# EAGLE schematic NHK2016mother (EAGLE 6.2)
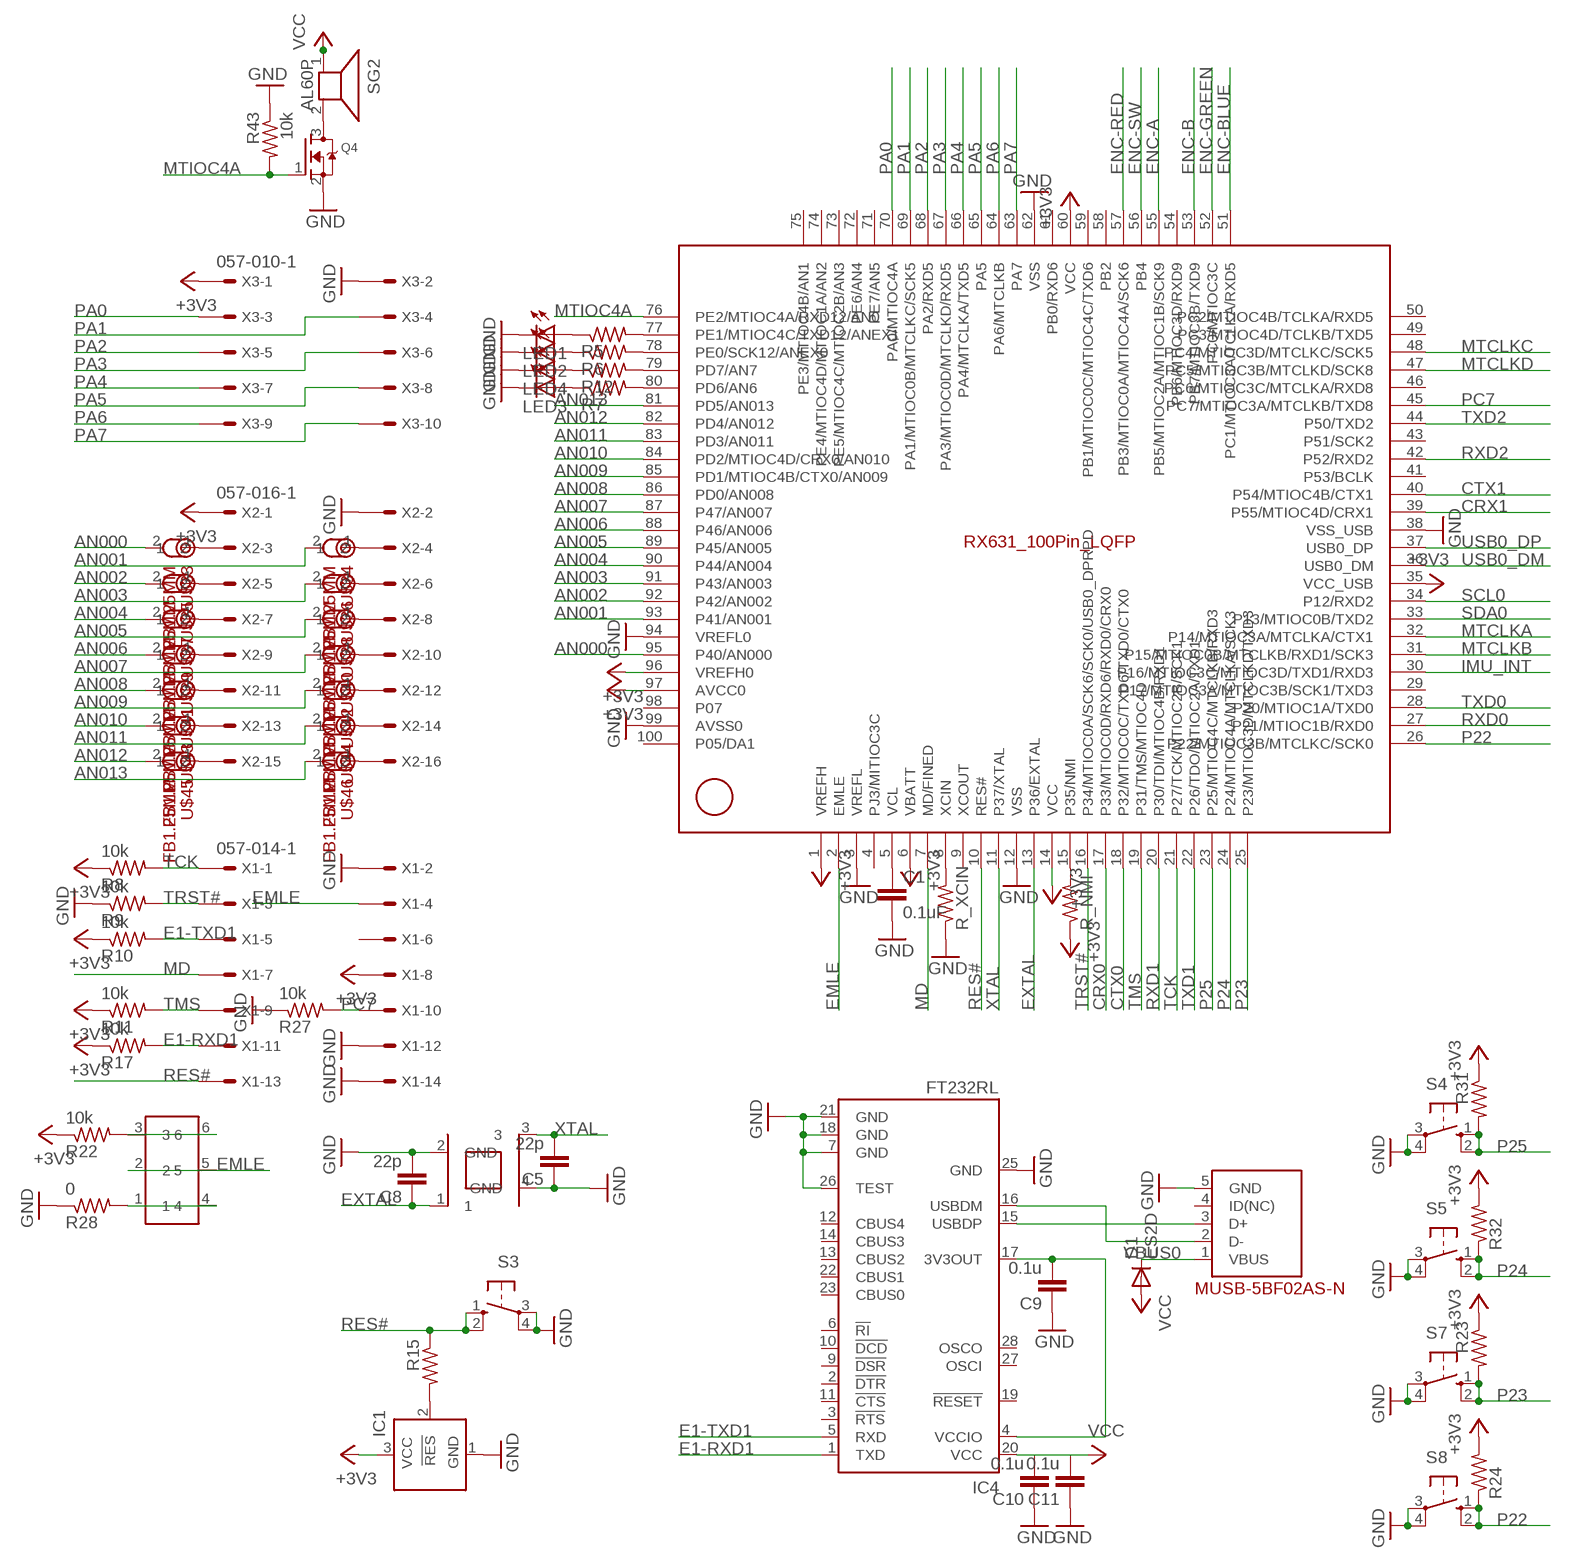
[diagram p0: schematic, sheet 1, part 1 of 2]
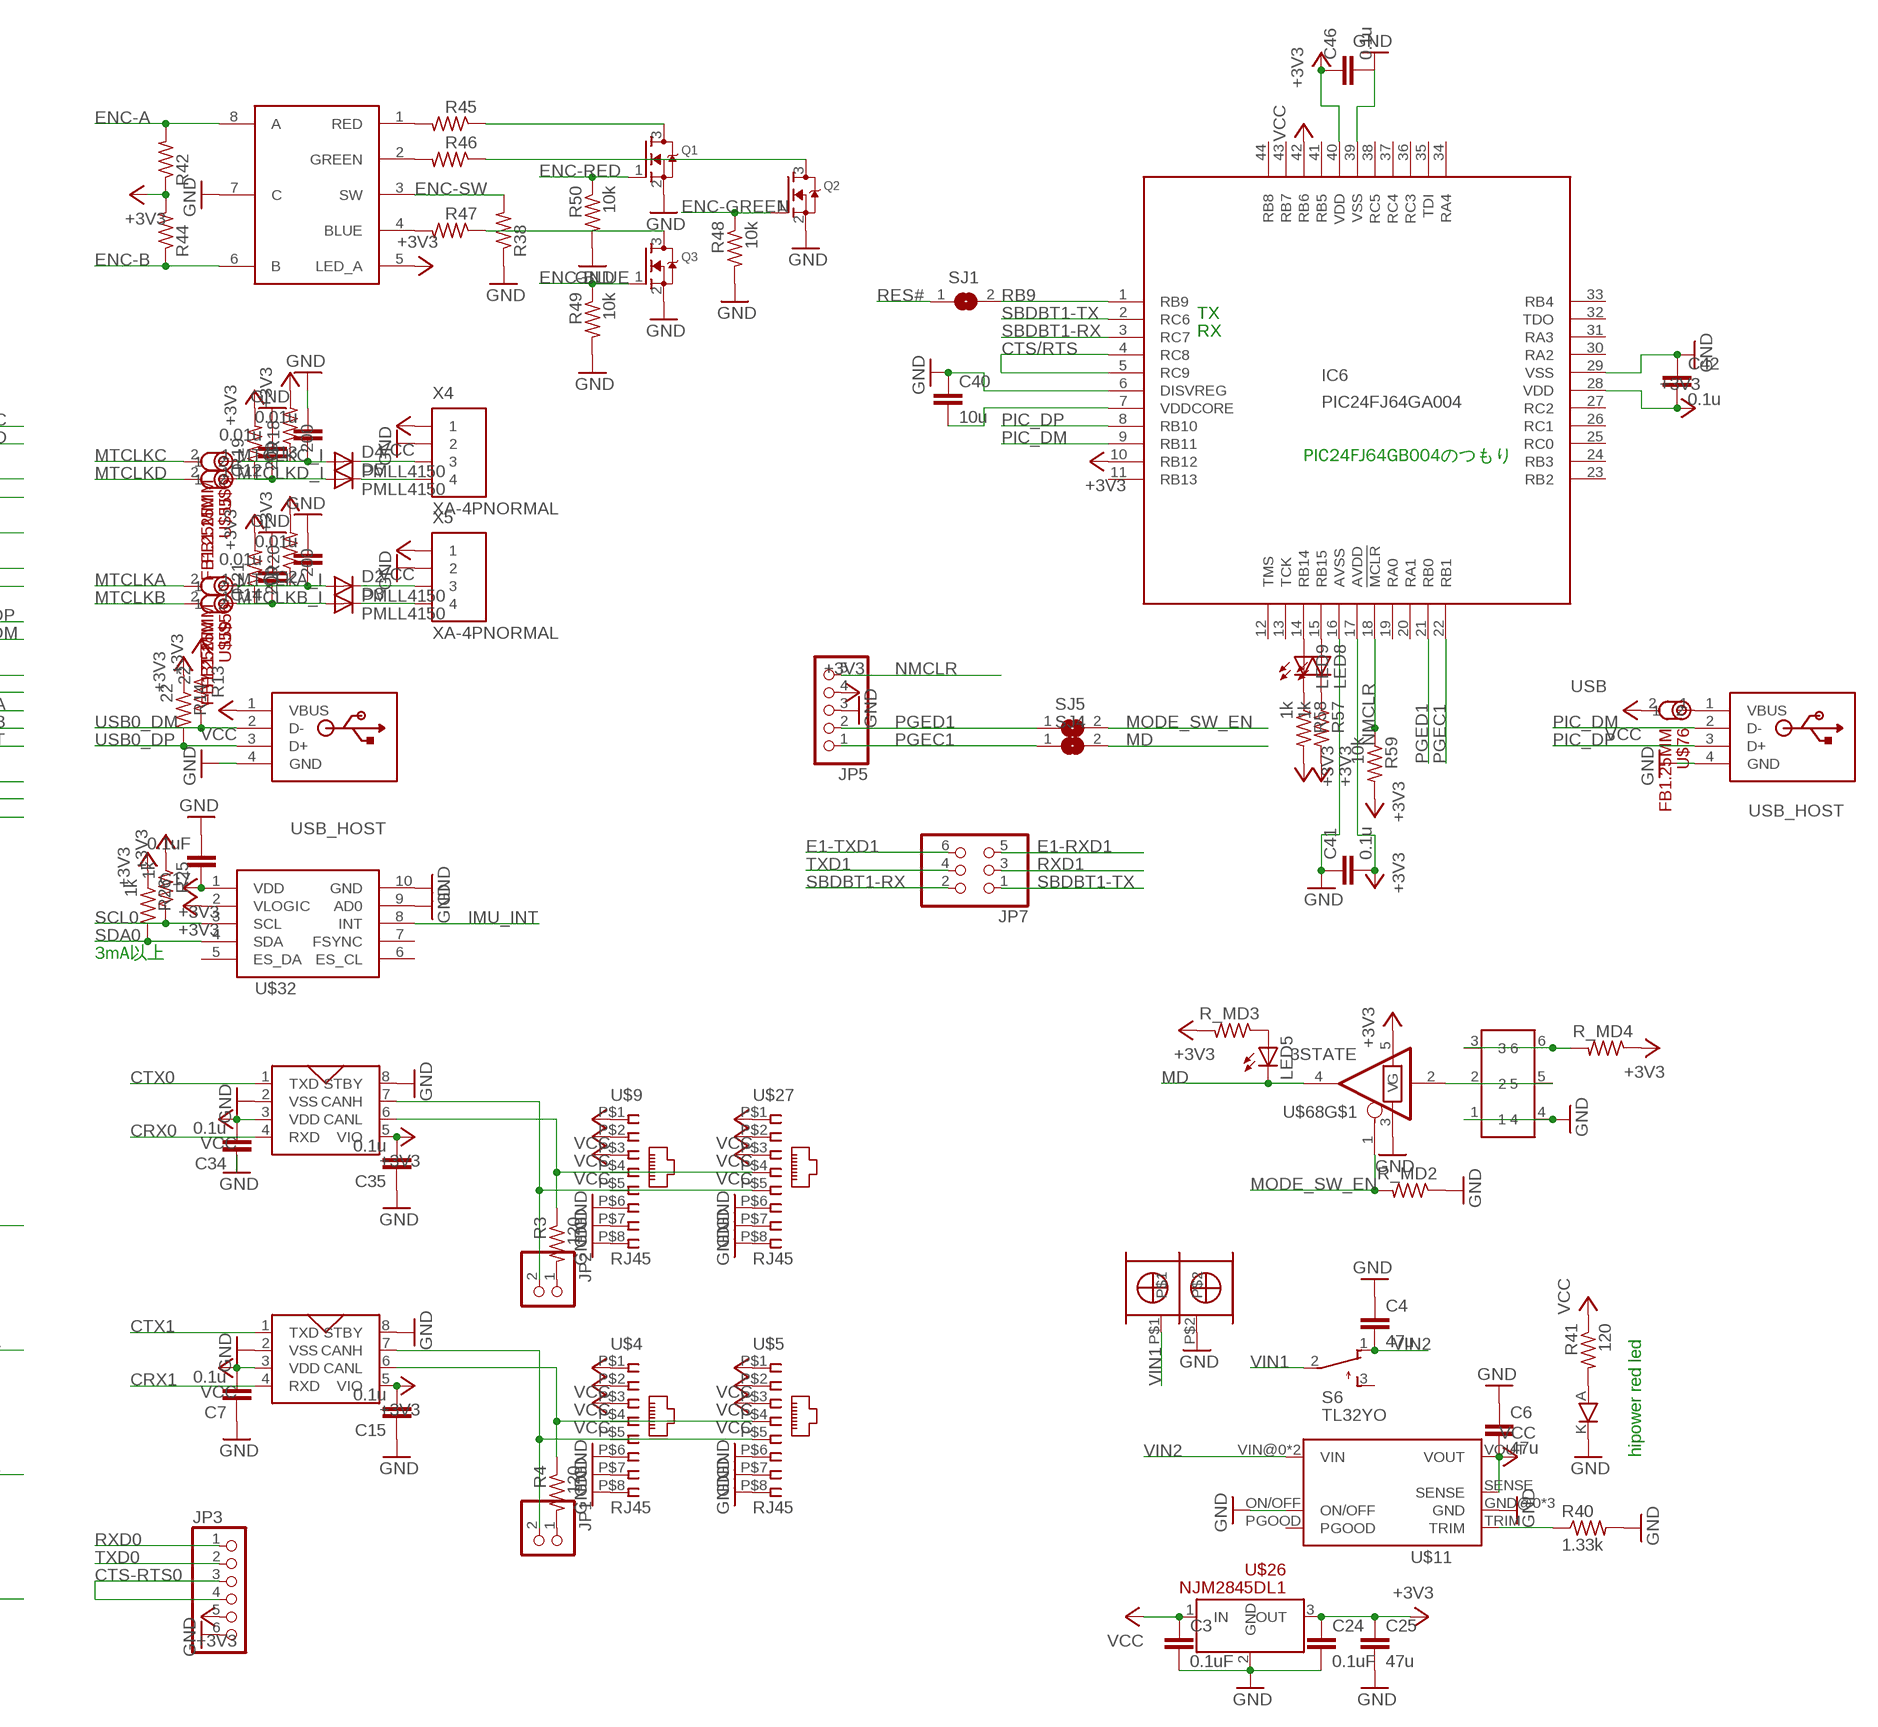
[diagram p1: schematic, sheet 1, part 2 of 2]

## Parts
C1  0.1uF  C-EUC0603K  [C0603K]
C2  0.01u  C-EUC0402  [C0402]
C3  0.1uF  C-EUC0603K  [C0603K]
C4  47u  C-EUC3225  [C3225]
C5  22p  C-EUC0603K  [C0603K]
C6  47u  C-EUC3225  [C3225]
C7  0.1u  C-EUC0402  [C0402]
C8  22p  C-EUC0603K  [C0603K]
C9  0.1u  C-EUC0402  [C0402]
C10  0.1u  C-EUC0402  [C0402]
C11  0.1u  C-EUC0402  [C0402]
C12  0.01u  C-EUC0402  [C0402]
C13  0.01u  C-EUC0402  [C0402]
C14  0.01u  C-EUC0402  [C0402]
C15  0.1u  C-EUC0402  [C0402]
C17  0.1uF  C-EUC0603K  [C0603K]
C24  0.1uF  C-EUC0603K  [C0603K]
C25  47u  C-EUC3225  [C3225]
C34  0.1u  C-EUC0402  [C0402]
C35  0.1u  C-EUC0402  [C0402]
C40  10u  C-EUC0603K  [C0603K]
C41  0.1u  C-EUC0603K  [C0603K]
C42  0.1u  C-EUC0603K  [C0603K]
C46  0.1u  C-EUC0603K  [C0603K]
D1  ES2D  [SMB]
D2  PMLL4150  [SOD80C]
D3  PMLL4150  [SOD80C]
D4  PMLL4150  [SOD80C]
D5  PMLL4150  [SOD80C]
IC1  TCM809  [SOT23B-3]
IC4  FT232RL  [SSOP28]
IC6  PIC24FJ64GA004  [TQFP44]
JP1  PINHD-1X2  [1X02]
JP2  PINHD-1X2  [1X02]
JP3  PINHD-1X6  [1X06]
JP5  PINHD-1X5  [1X05]
JP7  PINHD-2X3  [2X03]
LED1  LEDSML0805  [SML0805]
LED2  LEDSML0805  [SML0805]
LED3  LEDSML0805  [SML0805]
LED4  LEDSML0805  [SML0805]
LED5  LEDSML0805  [SML0805]
LED8  LEDSML0805  [SML0805]
LED9  LEDSML0805  [SML0805]
Q1  MOSFET-NREFLOW  [SOT23]
Q2  MOSFET-NREFLOW  [SOT23]
Q3  MOSFET-NREFLOW  [SOT23]
Q4  MOSFET-NREFLOW  [SOT23]
R3  120  R-US_MELF0102W  [MINI_MELF-0102W]
R4  120  R-US_MELF0102W  [MINI_MELF-0102W]
R5  R-US_MELF0102W  [MINI_MELF-0102W]
R6  R-US_MELF0102W  [MINI_MELF-0102W]
R7  R-US_MELF0102W  [MINI_MELF-0102W]
R8  10k  R-US_MELF0102W  [MINI_MELF-0102W]
R9  10k  R-US_MELF0102W  [MINI_MELF-0102W]
R10  10k  R-US_MELF0102W  [MINI_MELF-0102W]
R11  10k  R-US_MELF0102W  [MINI_MELF-0102W]
R12  R-US_MELF0102W  [MINI_MELF-0102W]
R13  22  R-US_MELF0102W  [MINI_MELF-0102W]
R14  22  R-US_MELF0102W  [MINI_MELF-0102W]
R15  R-US_MELF0102W  [MINI_MELF-0102W]
R17  10k  R-US_MELF0102W  [MINI_MELF-0102W]
R18  200  R-US_MELF0102W  [MINI_MELF-0102W]
R19  200  R-US_MELF0102W  [MINI_MELF-0102W]
R20  200  R-US_MELF0102W  [MINI_MELF-0102W]
R21  200  R-US_MELF0102W  [MINI_MELF-0102W]
R22  10k  R-US_MELF0102W  [MINI_MELF-0102W]
R23  R-US_MELF0102W  [MINI_MELF-0102W]
R24  R-US_MELF0102W  [MINI_MELF-0102W]
R25  1k  R-US_MELF0102W  [MINI_MELF-0102W]
R26  1k  R-US_MELF0102W  [MINI_MELF-0102W]
R27  10k  R-US_MELF0102W  [MINI_MELF-0102W]
R28  0  R-US_MELF0102W  [MINI_MELF-0102W]
R31  R-US_MELF0102W  [MINI_MELF-0102W]
R32  R-US_MELF0102W  [MINI_MELF-0102W]
R38  R-US_MELF0102W  [MINI_MELF-0102W]
R40  1.33k  R-US_MELF0102W  [MINI_MELF-0102W]
R41  120  R-US_MELF0102W  [MINI_MELF-0102W]
R42  R-US_MELF0102W  [MINI_MELF-0102W]
R43  10k  R-US_MELF0102W  [MINI_MELF-0102W]
R44  R-US_MELF0102W  [MINI_MELF-0102W]
R45  R-US_MELF0102W  [MINI_MELF-0102W]
R46  R-US_MELF0102W  [MINI_MELF-0102W]
R47  R-US_MELF0102W  [MINI_MELF-0102W]
R48  10k  R-US_MELF0102W  [MINI_MELF-0102W]
R49  10k  R-US_MELF0102W  [MINI_MELF-0102W]
R50  10k  R-US_MELF0102W  [MINI_MELF-0102W]
R57  1k  R-US_MELF0102W  [MINI_MELF-0102W]
R58  1k  R-US_MELF0102W  [MINI_MELF-0102W]
R59  10k  R-US_MELF0102W  [MINI_MELF-0102W]
R_MD2  R-US_MELF0102W  [MINI_MELF-0102W]
R_MD3  R-US_MELF0102W  [MINI_MELF-0102W]
R_MD4  R-US_MELF0102W  [MINI_MELF-0102W]
R_NMI  R-US_MELF0102W  [MINI_MELF-0102W]
R_XCIN  R-US_MELF0102W  [MINI_MELF-0102W]
S3  10-XX  [B3F-10XX]
S4  10-XX  [B3F-10XX]
S5  10-XX  [B3F-10XX]
S6  TL32YO  [TL3XYO]
S7  10-XX  [B3F-10XX]
S8  10-XX  [B3F-10XX]
SG2  AL60P  [AL60P]
SJ1  SJ  [SJ]
SJ4  SJ  [SJ]
SJ5  SJ  [SJ]
U$1  R5F5631FDDFP  [LQFP100]
U$2  MUSB-5BF02AS-N  [MUSB-5BF02AS-N]
U$3  MCP2562  [MCP2562]
U$4  RJ45  [RJ45]
U$5  RJ45  [RJ45]
U$6  FB1.25MM  [2012]
U$7  SSSS2  [SSSS2]
U$8  ＦＲ１１０５Ｗ－ＴＲ  [ＦＲ１１０５Ｗ－ＴＲ]
U$9  RJ45  [RJ45]
U$10  TERMINAL  [TERMINAL]
U$11  OKL_T6_W12  [OKL_T6_W12]
U$17  MCP2562  [MCP2562]
U$26  NJM2845DL1  [TO-252-3-L1]
U$27  RJ45  [RJ45]
U$29  USB_A  [USB_A]
U$32  MPU9150  [MPU9150]
U$33  FB1.25MM  [2012]
U$34  FB1.25MM  [2012]
U$35  FB1.25MM  [2012]
U$36  FB1.25MM  [2012]
U$37  FB1.25MM  [2012]
U$38  FB1.25MM  [2012]
U$39  FB1.25MM  [2012]
U$40  FB1.25MM  [2012]
U$41  FB1.25MM  [2012]
U$42  FB1.25MM  [2012]
U$43  FB1.25MM  [2012]
U$44  FB1.25MM  [2012]
U$45  FB1.25MM  [2012]
U$46  FB1.25MM  [2012]
U$55  FB1.25MM  [2012]
U$56  FB1.25MM  [2012]
U$58  EC12PLRGBSDVBF  [EC12PLRGBSDVBF]
U$59  FB1.25MM  [2012]
U$61  FA238V  [FA238V]
U$68  3STATE  [SOT23-5]
U$75  USB_A  [USB_A]
U$76  FB1.25MM  [2012]
U$82  SSSS2  [SSSS2]
X1  057-014-1  [057-014-1]
X2  057-016-1  [057-016-1]
X3  057-010-1  [057-010-1]
X4  XA-4PNORMAL  [XA-4P]
X5  XA-4PNORMAL  [XA-4P]

## Nets
+3V3: C15.2 C17.1 C24.1 C25.1 C35.2 C41.2 C42.2 C46.1 IC1.3(VCC) IC6.10(RB12) IC6.17(AVDD) IC6.28(VDD) IC6.40(VDD) JP3.5 JP5.4 R8.1 R10.1 R11.1 R13.1 R14.1 R17.1 R18.2 R19.2 R20.2 R21.2 R22.1 R23.1 R24.2 R25.1 R26.1 R31.1 R32.2 R42.1 R44.2 R57.2 R58.2 R59.2 R_MD3.2 R_MD4.1 R_NMI.1 U$1.1(VREFH) U$1.6(VBATT) U$1.14(VCC) U$1.35(VCC_USB) U$1.60(VCC) U$1.96(VREFH0) U$1.97(AVCC0) U$3.5(VIO) U$17.5(VIO) U$26.3(OUT) U$32.1(VDD) U$32.2(VLOGIC) U$58.5(LED_A) U$68.5(V) X1.8 X2.1 X3.1
AN000: U$1.95(P40/AN000) U$33.2
AN001: U$1.93(P41/AN001) U$34.2
AN002: U$1.92(P42/AN002) U$35.2
AN003: U$1.91(P43/AN003) U$36.2
AN004: U$1.90(P44/AN004) U$37.2
AN005: U$1.89(P45/AN005) U$38.2
AN006: U$1.88(P46/AN006) U$39.2
AN007: U$1.87(P47/AN007) U$40.2
AN008: U$1.86(PD0/AN008) U$41.2
AN009: U$1.85(PD1/MTIOC4B/CTX0/AN009) U$42.2
AN010: U$1.84(PD2/MTIOC4D/CRX0/AN010) U$43.2
AN011: U$1.83(PD3/AN011) U$44.2
AN012: U$1.82(PD4/AN012) U$45.2
AN013: U$1.81(PD5/AN013) U$46.2
CRX0: U$1.17(P33/MTIOC0D/RXD6/RXD0/CRX0) U$17.4(RXD)
CRX1: U$1.39(P55/MTIOC4D/CRX1) U$3.4(RXD)
CTS-RTS0: JP3.3 JP3.4
CTS/RTS: IC6.4(RC8) IC6.5(RC9)
CTX0: U$1.18(P32/MTIOC0C/TXD6/TXD0/CTX0) U$17.1(TXD)
CTX1: U$1.40(P54/MTIOC4B/CTX1) U$3.1(TXD)
E1-RXD1: IC4.1(TXD) JP7.5 R17.2 X1.11
E1-TXD1: IC4.5(RXD) JP7.6 R10.2 X1.5
EMLE: U$1.2(EMLE) U$7.2 U$7.5 X1.4
ENC-A: R42.2 U$1.55(PB5/MTIOC2A/MTIOC1B/SCK9) U$58.8(A)
ENC-B: R44.1 U$1.53(PB7/MTIOC3B/TXD9) U$58.6(B)
ENC-BLUE: Q3.1(G) R49.1 U$1.51(PC1/MTIOC3A/TCLKA/RXD5)
ENC-GREEN: Q2.1(G) R48.1 U$1.52(PC0/MTIOC3C)
ENC-RED: Q1.1(G) R50.1 U$1.57(PB3/MTIOC0A/MTIOC4A/SCK6)
ENC-SW: R38.2 U$1.56(PB4) U$58.3(SW)
EXTAL: C8.1 U$1.13(P36/EXTAL) U$61.1
GND: C1.2 C2.2 C3.2 C4.1 C5.1 C6.1 C7.1 C8.2 C9.1 C10.1 C11.1 C12.2 C13.2 C14.2 C15.1 C17.2 C24.2 C25.2 C34.1 C35.1 C40.1 C41.1 C42.1 C46.2 IC1.1(GND) IC4.7(GND) IC4.18(GND) IC4.21(GND) IC4.25(GND) IC4.26(TEST) IC6.6(DISVREG) IC6.16(AVSS) IC6.29(VSS) IC6.39(VSS) JP3.6 JP5.3 LED1.C LED2.C LED3.C LED4.C Q1.2(S) Q2.2(S) Q3.2(S) Q4.2(S) R9.1 R27.1 R28.1 R38.1 R40.2 R43.1 R48.2 R49.2 R50.2 R_MD2.1 R_XCIN.1 S3.3(P) S3.4(P1) S4.3(P) S4.4(P1) S5.3(P) S5.4(P1) S7.3(P) S7.4(P1) S8.3(P) S8.4(P1) U$1.3(VREFL) U$1.12(VSS) U$1.38(VSS_USB) U$1.62(VSS) U$1.94(VREFL0) U$1.99(AVSS0) U$2.5(GND) U$3.2(VSS) U$3.8(STBY) U$4.P$6 U$4.P$7 U$4.P$8 U$5.P$6 U$5.P$7 U$5.P$8 U$8.K U$9.P$6 U$9.P$7 U$9.P$8 U$10.P$2 U$11.GND@0(GND) U$11.GND@1(GND) U$11.GND@2(GND) U$11.ON/OFF U$17.2(VSS) U$17.8(STBY) U$26.2(GND) U$27.P$6 U$27.P$7 U$27.P$8 U$29.4(GND) U$32.9(AD0) U$32.10(GND) U$58.7(C) U$61.2(GND) U$61.4(GND) U$68.3(G) U$75.4(GND) U$82.1 U$82.4 X1.2 X1.12 X1.14 X2.2 X3.2 X4.2 X5.2
IMU_INT: U$1.30(P16/MTIOC3C/MTIOC3D/TXD1/RXD3) U$32.8(INT)
MD: LED5.C SJ4.2 U$1.7(MD/FINED) U$68.4(O) X1.7
MODE_SW_EN: R_MD2.2 SJ5.2 U$68.1(OE)
MTCLKA: U$1.32(P14/MTIOC3A/MTCLKA/CTX1) U$56.2
MTCLKA_I: C2.1 D2.A R20.1 U$56.1
MTCLKB: U$1.31(P15/MTIOC0B/MTCLKB/RXD1/SCK3) U$59.2
MTCLKB_I: C14.1 D3.A R21.1 U$59.1
MTCLKC: U$1.48(PC4/MTIOC3D/MTCLKC/SCK5) U$6.2
MTCLKC_I: C13.1 D4.A R18.1 U$6.1
MTCLKD: U$1.47(PC5/MTIOC3B/MTCLKD/SCK8) U$55.2
MTCLKD_I: C12.1 D5.A R19.1 U$55.1
MTIOC4A: Q4.1(G) R43.2 U$1.76(PE2/MTIOC4A/RXD12/AN0)
N$1: R_XCIN.2 U$1.8(XCIN)
N$2: R_NMI.2 U$1.15(P35/NMI)
N$3: LED5.A R_MD3.1
N$4: R22.2 U$7.3 U$7.6
N$5: IC4.16(USBDM) U$2.2(D-)
N$6: IC4.15(USBDP) U$2.3(D+)
N$7: JP2.1 R3.2
N$8: JP1.2 U$3.7(CANH) U$4.P$5 U$5.P$5
N$9: R4.1 U$3.6(CANL) U$4.P$4 U$5.P$4
N$10: JP1.1 R4.2
N$11: R5.2 U$1.77(PE1/MTIOC4C/TXD12/ANEX1)
N$12: R6.2 U$1.78(PE0/SCK12/ANEX0)
N$13: R7.2 U$1.80(PD6/AN6)
N$14: JP2.2 U$9.P$5 U$17.7(CANH) U$27.P$5
N$15: R3.1 U$9.P$4 U$17.6(CANL) U$27.P$4
N$16: LED1.A R5.1
N$17: IC1.2(!RES) R15.2
N$18: LED2.A R6.1
N$19: LED3.A R7.1
N$20: R12.2 U$1.79(PD7/AN7)
N$21: LED4.A R12.1
N$22: C9.2 IC4.4(VCCIO) IC4.17(3V3OUT)
N$24: R28.2 U$7.1 U$7.4
N$25: D5.C X4.4
N$26: D4.C X4.3
N$27: D2.C X5.3
N$28: D3.C X5.4
N$29: R41.2 U$8.A
N$30: R40.1 U$11.TRIM
N$32: C1.1 U$1.5(VCL)
N$59: U$33.1 X2.3
N$60: U$34.1 X2.4
N$61: U$35.1 X2.5
N$62: U$36.1 X2.6
N$63: U$37.1 X2.7
N$64: U$38.1 X2.8
N$65: U$39.1 X2.9
N$66: U$40.1 X2.10
N$67: U$41.1 X2.11
N$68: U$42.1 X2.12
N$69: U$43.1 X2.13
N$70: U$44.1 X2.14
N$71: U$45.1 X2.15
N$72: U$46.1 X2.16
N$77: Q4.3(D) SG2.2
N$86: Q1.3(D) R45.1
N$90: U$68.2(I) U$82.2 U$82.5
N$91: R45.2 U$58.1(RED)
N$93: R46.2 U$58.2(GREEN)
N$94: R47.2 U$58.4(BLUE)
N$95: Q2.3(D) R46.1
N$96: Q3.3(D) R47.1
N$98: LED8.C R57.1
N$99: LED9.C R58.1
N$100: IC6.15(RB15) LED8.A
N$101: IC6.14(RB14) LED9.A
N$102: C40.2 IC6.7(VDDCORE)
N$103: U$75.1(VBUS) U$76.1
N$104: R_MD4.2 U$82.3 U$82.6
NMCLR: IC6.18(!MCLR) JP5.5 R59.1
P22: R24.1 S8.1(S) S8.2(S1) U$1.26(P22/MTIOC3B/MTCLKC/SCK0)
P23: R23.2 S7.1(S) S7.2(S1) U$1.25(P23/MTIOC3D/MTCLKD/TXD3)
P24: R32.1 S5.1(S) S5.2(S1) U$1.24(P24/MTIOC4A/MTCLKA/SCK3)
P25: R31.2 S4.1(S) S4.2(S1) U$1.23(P25/MTIOC4C/MTCLKB/RXD3)
PA0: U$1.70(PA0/MTIOC4A) X3.3
PA1: U$1.69(PA1/MTIOC0B/MTCLKC/SCK5) X3.4
PA2: U$1.68(PA2/RXD5) X3.5
PA3: U$1.67(PA3/MTIOC0D/MTCLKD/RXD5) X3.6
PA4: U$1.66(PA4/MTCLKA/TXD5) X3.7
PA5: U$1.65(PA5) X3.8
PA6: U$1.64(PA6/MTCLKB) X3.9
PA7: U$1.63(PA7) X3.10
PC7: R27.2 U$1.45(PC7/MTIOC3A/MTCLKB/TXD8) X1.10
PGEC1: IC6.22(RB1) JP5.1 SJ4.1
PGED1: IC6.21(RB0) JP5.2 SJ5.1
PIC_DM: IC6.9(RB11) U$75.2(D-)
PIC_DP: IC6.8(RB10) U$75.3(D+)
RB9: IC6.1(RB9) SJ1.2
RES#: R15.1 S3.1(S) S3.2(S1) SJ1.1 U$1.10(RES#) X1.13
RXD0: JP3.1 U$1.27(P21/MTIOC1B/RXD0)
RXD1: JP7.3 U$1.20(P30/TDI/MTIOC4B/RXD1)
RXD2: U$1.42(P52/RXD2)
SBDBT1-RX: IC6.3(RC7) JP7.2
SBDBT1-TX: IC6.2(RC6) JP7.1
SCL0: R25.2 U$1.34(P12/RXD2) U$32.3(SCL)
SDA0: R26.2 U$1.33(P13/MTIOC0B/TXD2) U$32.4(SDA)
TCK: R8.2 U$1.21(P27/TCK/MTIOC2B/SCK1) X1.1
TMS: R11.2 U$1.19(P31/TMS/MTIOC4D) X1.9
TRST#: R9.2 U$1.16(P34/MTIOC0A/SCK6/SCK0/USB0_DPRPD) X1.3
TXD0: JP3.2 U$1.28(P20/MTIOC1A/TXD0)
TXD1: JP7.4 U$1.22(P26/TDO/MTIOC2A/TXD1)
TXD2: U$1.44(P50/TXD2)
USB0_DM: R13.2 U$1.36(USB0_DM) U$29.2(D-)
USB0_DP: R14.2 U$1.37(USB0_DP) U$29.3(D+)
VBUS0: D1.C U$2.1(VBUS)
VCC: C3.1 C6.2 C7.2 C10.2 C11.2 C34.2 D1.A IC4.20(VCC) IC6.42(RB6) R41.1 SG2.1 U$3.3(VDD) U$4.P$1 U$4.P$2 U$4.P$3 U$5.P$1 U$5.P$2 U$5.P$3 U$9.P$1 U$9.P$2 U$9.P$3 U$11.SENSE U$11.VOUT U$17.3(VDD) U$26.1(IN) U$27.P$1 U$27.P$2 U$27.P$3 U$29.1(VBUS) U$76.2 X4.1 X5.1
VIN1: S6.2(P) U$10.P$1
VIN2: C4.2 S6.1(O) U$11.VIN@0(VIN) U$11.VIN@1(VIN)
XTAL: C5.2 U$1.11(P37/XTAL) U$61.3
Unconnected: IC4.2(!DTR) IC4.3(!RTS) IC4.6(!RI) IC4.9(!DSR) IC4.10(!DCD) IC4.11(!CTS) IC4.12(CBUS4) IC4.13(CBUS2) IC4.14(CBUS3) IC4.19(!RESET) IC4.22(CBUS1) IC4.23(CBUS0) IC4.27(OSCI) IC4.28(OSCO) IC6.11(RB13) IC6.12(TMS) IC6.13(TCK) IC6.19(RA0) IC6.20(RA1) IC6.23(RB2) IC6.24(RB3) IC6.25(RC0) IC6.26(RC1) IC6.27(RC2) IC6.30(RA2) IC6.31(RA3) IC6.32(TDO) IC6.33(RB4) IC6.34(RA4) IC6.35(TDI) IC6.36(RC3) IC6.37(RC4) IC6.38(RC5) IC6.41(RB5) IC6.43(RB7) IC6.44(RB8) S6.3(S) U$1.4(PJ3/MITIOC3C) U$1.9(XCOUT) U$1.29(P17/MTIOC3A/MTIOC3B/SCK1/TXD3) U$1.41(P53/BCLK) U$1.43(P51/SCK2) U$1.46(PC6/MTIOC3C/MTCLKA/RXD8) U$1.49(PC3/MTIOC4D/TCLKB/TXD5) U$1.50(PC2/MTIOC4B/TCLKA/RXD5) U$1.54(PB6/MTIOC3D/RXD9) U$1.58(PB2) U$1.59(PB1/MTIOC0C/MTIOC4C/TXD6) U$1.61(PB0/RXD6) U$1.71(PE7/AN5) U$1.72(PE6/AN4) U$1.73(PE5/MTIOC4C/MTIOC2B/AN3) U$1.74(PE4/MTIOC4D/MTIOC1A/AN2) U$1.75(PE3/MTIOC4B/AN1) U$1.98(P07) U$1.100(P05/DA1) U$2.4(ID(NC)) U$11.PGOOD U$32.5(ES_DA) U$32.6(ES_CL) U$32.7(FSYNC) X1.6

## Notes on the sheet
- TX
- RX
- PIC24FJ64GB004のつもり
- USB
- USB_HOST
- USB_HOST
- 3mA以上
- hipower red led

## Library data of the parts
C1-C15 C17 C24 C25 C34 C35 C40-C42 C46 = rcl:C-EU: CAPACITOR, European symbol
D1 = diode:ES2D: DIODE super fast rectifier, 2 A
D2-D5 = diode:PMLL4150: DIODE high speed
IC1 = telcom:TCM809: POWER SUPPLY MONITOR replacement for Maxim MAX809 and MAX810; MF: MICROCHIP; MPN: TCM809MENB713; OC_FARNELL: 9762744; OC_NEWARK: 96K3998
IC4 = ftdichip:FT232R: Source: http://www.ftdichip.com/Documents/DataSheets/DS_FT232R_v104.pdf; MPN: FT232RL; OC_FARNELL: 1146032; OC_NEWARK: 91K9918
IC6 = microchip:PIC24FJ64GA004: PIC24FJ64GA004 edit this description Auto generated by make-symbol-device-package-bsdl.ulp Rev. 25 Source: PIC24FJ64GA004.bsd; MPN: PIC24FJ64GA004-E/PT; OC_FARNELL: 1332299; OC_NEWARK: 98M1927
JP1 JP2 = pinhead:PINHD-1X2: PIN HEADER
JP3 = pinhead:PINHD-1X6: PIN HEADER
JP5 = pinhead:PINHD-1X5: PIN HEADER
JP7 = pinhead:PINHD-2X3: PIN HEADER
LED1-LED5 LED8 LED9 = led:LED: LED OSRAM: - CHIPLED LG R971, LG N971, LY N971, LG Q971, LY Q971, LO R971, LY R971 LH N974, LH R974 LS Q976, LO Q976, LY Q976 LO Q996 - Hyper CHIPLED LW Q18S LB Q993, LB Q99A, LB R99A - SideLED LS A670, LO A670, LY A670, LG A670, LP A670 LB A673, LV A673, LT A673, LW A673 LH A674 LY A675 LS A676, LA A676, LO A676, LY A676, LW A676 LS A679, LY A679, LG A679 - Hyper Micro SIDELED® LS Y876, LA Y876, LO Y876, LY Y876 LT Y87S - SmartLED LW L88C, LW L88S LB L89C, LB L89S, LG L890 LS L89K, LO L89K, LY L89K LS L896, LA L896, LO L896, LY L896 - TOPLED LS T670, LO T670, LY T670, LG T670, LP T670 LSG T670, LSP T670, LSY T670, LOP T670, LYG T670 LG T671, LOG T671, LSG T671 LB T673, LV T673, LT T673, LW T673 LH T674 LS T676, LA T676, LO T676, LY T676, LB T676, LH T676, LSB T676, LW T676 LB T67C, LV T67C, LT T67C, LS T67K, LO T67K, LY T67K, LW E67C LS E67B, LA E67B, LO E67B, LY E67B, LB E67C, LV E67C, LT E67C LW T67C LS T679, LY T679, LG T679 LS T770, LO T770, LY T770, LG T770, LP T770 LB T773, LV T773, LT T773, LW T773 LH T774 LS E675, LA E675, LY E675, LS T675 LS T776, LA T776, LO T776, LY T776, LB T776 LHGB T686 LT T68C, LB T68C - Hyper Mini TOPLED® LB M676 - Mini TOPLED Santana® LG M470 LS M47K, LO M47K, LY M47K Source: http://www.osram.convergy.de LUXEON: - LUMILED® LXK2-PW12-R00, LXK2-PW12-S00, LXK2-PW14-U00, LXK2-PW14-V00 LXK2-PM12-R00, LXK2-PM12-S00, LXK2-PM14-U00 LXK2-PE12-Q00, LXK2-PE12-R00, LXK2-PE12-S00, LXK2-PE14-T00, LXK2-PE14-U00 LXK2-PB12-K00, LXK2-PB12-L00, LXK2-PB12-M00, LXK2-PB14-N00, LXK2-PB14-P00, LXK2-PB14-Q00 LXK2-PR12-L00, LXK2-PR12-M00, LXK2-PR14-Q00, LXK2-PR14-R00 LXK2-PD12-Q00, LXK2-PD12-R00, LXK2-PD12-S00 LXK2-PH12-R00, LXK2-PH12-S00 LXK2-PL12-P00, LXK2-PL12-Q00, LXK2-PL12-R00 Source: www.luxeon.com KINGBRIGHT: KA-3528ASYC Source: www.kingbright.com
Q1-Q4 = adafruit:MOSFET-N: N-Channel Mosfet 2N7002E - 60V 260mA SOT23 [Digikey: 2N7002ET1GOSTR-ND] - REEL BSH103 - 30V 850mA SOT23 [Digikey: 568-5013-1-ND]
R3-R15 R17-R28 R31 R32 R38 R40-R50 R57-R59 R_MD2-R_MD4 R_NMI R_XCIN = rcl:R-US_: RESISTOR, American symbol
S3-S5 S7 S8 = switch-omron:10-XX: OMRON SWITCH; MPN: B3F-1000; OC_FARNELL: 176432; OC_NEWARK: 36M3542
S6 = switch:TL32YO: TINY SWITCH ON - MOM Source: http://www2.produktinfo.conrad.com/datenblaetter/700000-724999/705152-da-01-de-Subminiaturschalter_TL_36YO.pdf
SG2 = buzzer:AL60P: SPEAKER Source: Buerklin; OC_FARNELL: unknown; OC_NEWARK: unknown
SJ1 SJ4 SJ5 = jumper:SJ: SMD solder JUMPER
U$1 = RX631:R5F5631FDDFP
U$2 = kerawo:MUSB-5BF02AS-N
U$3 U$17 = kerawo:MCP2562
U$4 U$5 U$9 U$27 = 0Lib:RJ45
U$6 U$33-U$46 U$55 U$56 U$59 U$76 = CQ:FB1.25MM: MURATA Power Line Chip Ferrite Beads BLM21P <http://akizukidenshi.com/download/BLM21PG331SN.pdf> BLM21PG220SN1p 22Ω±25% 6000mA 0.01Ω -55℃～+125℃ BLM21PG300SN1p 30Ω(Typ.) 3000mA 0.015Ω -55℃～+125℃ BLM21PG600SN1p 60Ω±25% 3000mA 0.025Ω -55℃～+125℃ BLM21PG121SN1p 120Ω±25% 3000mA 0.03Ω -55℃～+125℃ BLM21PG221SN1p 220Ω±25% 2000mA 0.050Ω -55℃～+125℃ BLM21PG331SN1p 330Ω±25% 1500mA 0.09Ω -55℃～+125℃
U$7 U$82 = kerawo:SSSS2
U$8 = FR1105W-TR:ＦＲ１１０５Ｗ－ＴＲ
U$10 = 0Lib:TERMINAL
U$11 = 0Lib:OKL_T6_W12
U$26 = CQ:NJM2845DL1: NJM Low Dropout Regulator 0.18V dropout at 500mA NJM2845 <http://semicon.njr.co.jp/jpn/PDF/NJM2845_NJM2846_J.pdf> Package <http://semicon.njr.co.jp/jpn/PDF/package/TO-252-3-L1_J.pdf>
U$29 U$75 = 0Lib:USB_A
U$32 = 0Lib:MPU9150
U$58 = 0Lib:EC12PLRGBSDVBF
U$61 = kerawo:FA238V
U$68 = 0Lib:3STATE
X1 = con-panduit:057-014-: CONNECTOR 10-pin series 057 contact pc board low profile headers; OC_FARNELL: unknown; OC_NEWARK: unknown
X2 = con-panduit:057-016-: CONNECTOR 10-pin series 057 contact pc board low profile headers; OC_FARNELL: unknown; OC_NEWARK: unknown
X3 = con-panduit:057-010-: CONNECTOR 10-pin series 057 contact pc board low profile headers; OC_FARNELL: unknown; OC_NEWARK: unknown
X4 X5 = XA-Connectors:XA-4P